# Altium schematic sheet CONTINUE.SchDoc
size 420 x 297 mm; SheetNumber: 5; SheetTotal: 5
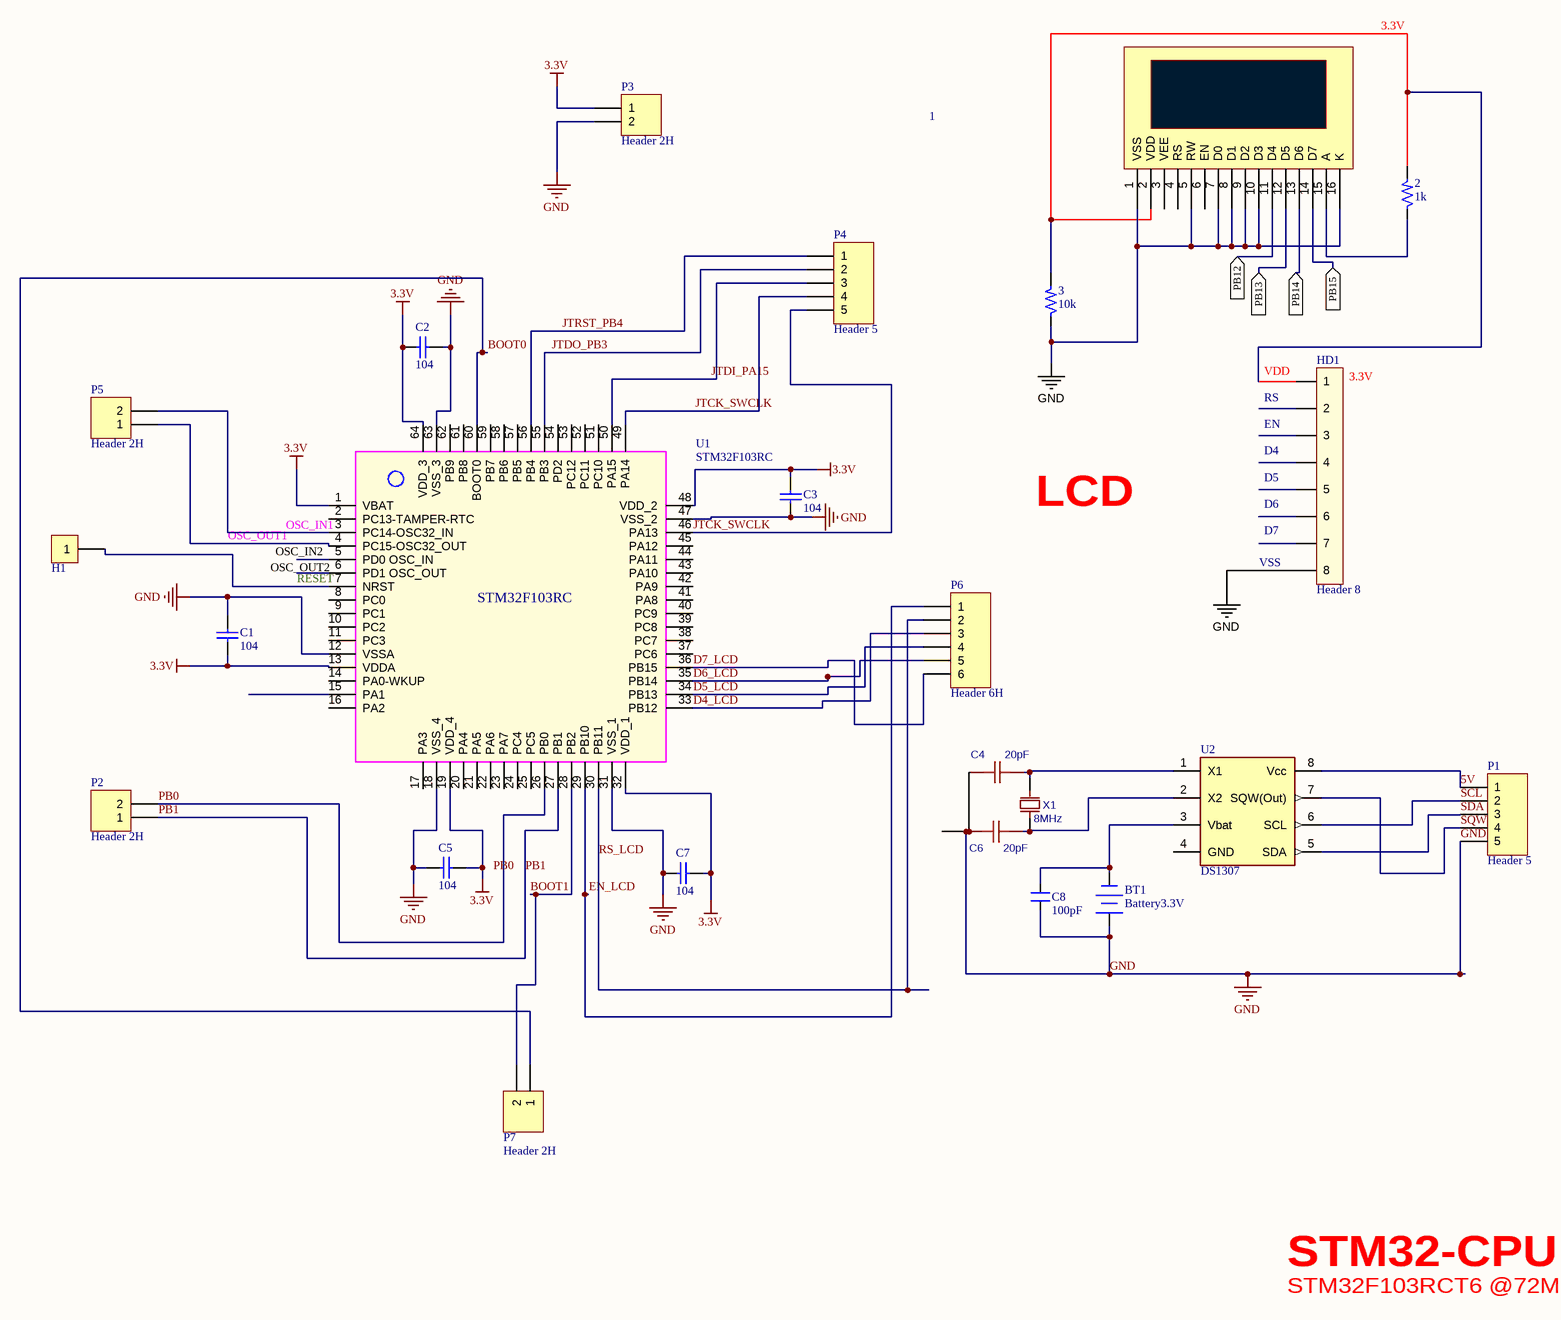
[diagram p0: CONTINUE.SchDoc]

## Parts
1  LCD  [LCD16X2]  (value not drawn)
2  1k  [R1/6W]
3  10k  [R1/6W]
BT1  Battery3.3V  [CR2032 Holder]
C1  104  [0805]
C2  104  [0805]
C3  104  [0805]
C4  20pF  [C0603]
C5  104  [0805]
C6  20pF  [C0603]
C7  104  [0805]
C8  100pF  [CN1]
H1  Header 1  [HEAD1]  (value not drawn)
HD1  Header 8  [HED8V]
P1  Header 5
P2  Header 2H  [HDR1X2H]
P3  Header 2H  [HDR1X2H]
P4  Header 5
P5  Header 2H  [HDR1X2H]
P6  Header 6H  [HDR1X6H]
P7  Header 2H  [HDR1X2H]
U1  STM32F103RC  [STM32F103RC_TSQFP]
U2  DS1307  [DIP.100/8/W.300/L.400]
X1  8MHz  [HC-49SMD]

## Ports
PB12 (in), PB13 (in), PB14 (in), PB15 (in)

## Nets
3.3V: C1.1 C2.1 C3.1 C5.1 C7.1 P3.1 U1.1(VBAT) U1.13(VDDA) U1.19(VDD_4) U1.32(VDD_1) U1.48(VDD_2) U1.64(VDD_3)
GND: 1.1(VSS) 1.5(RW) 1.7(D0) 1.8(D1) 1.9(D2) 1.10(D3) 1.16(K) 3.1 BT1.1(+) C1.2 C2.2 C3.2 C4.1 C5.2 C6.1 C7.2 C8.1 HD1.8 P1.5 P3.2 U1.12(VSSA) U1.18(VSS_4) U1.31(VSS_1) U1.47(VSS_2) U1.63(VSS_3)
5V: P1.1 U2.8(Vcc)
BOOT0: P7.1 U1.60(BOOT0)
BOOT1: P7.2 U1.28(PB2)
D4_LCD: P6.3 U1.33(PB12)
D5_LCD: P6.4 U1.34(PB13)
D6_LCD: P6.5 U1.35(PB14)
D7_LCD: P6.6 U1.36(PB15)
EN_LCD: P6.1 U1.29(PB10)
JTCK_SWCLK: P4.4 P4.5 U1.46(PA13) U1.49(PA14)
JTDI_PA15: P4.3 U1.50(PA15)
JTDO_PB3: P4.2 U1.55(PB3)
JTRST_PB4: P4.1 U1.56(PB4)
OSC_IN1: P5.2 U1.3(PC14-OSC32_IN)
OSC_OUT1: P5.1 U1.4(PC15-OSC32_OUT)
PB0: P2.2 U1.26(PB0)
PB1: P2.1 U1.27(PB1)
PB12: 1.11(D4) ; port PB12
PB13: 1.12(D5) ; port PB13
PB14: 1.13(D6) ; port PB14
PB15: 1.14(D7) ; port PB15
RESET: H1.1 U1.7(NRST)
RS_LCD: P6.2 U1.30(PB11)
SCL: P1.2 U2.6(SCL)
SDA : P1.3 U2.5(SDA)
SQW: P1.4 U2.7(SQW(Out))
Net1_2: 1.2(VDD) 2.2 3.2 HD1.1
Net1_15: 1.15(A) 2.1
NetBT1_2: BT1.2(-) C8.2 U2.3(Vbat)
NetC4_2: C4.2 U2.1(X1) X1.1(OSC1)
NetC6_2: C6.2 U2.2(X2) X1.2(OSC2)

Not connected (* = marked no-connect by the designer): 1 3(VEE) 4(RS) 6(EN); HD1 2 3 4 5 6 7; U1 2(PC13-TAMPER-RTC) 5(PD0_OSC_IN) 6(PD1_OSC_OUT) 8(PC0) 9(PC1) 10(PC2) 11(PC3) 14(PA0-WKUP) 15(PA1) 16(PA2) 17(PA3) 20(PA4) 21(PA5) 22(PA6) 23(PA7) 24(PC4) 25(PC5) 37(PC6) 38(PC7) 39(PC8) 40(PC9) 41(PA8) 42(PA9) 43(PA10) 44(PA11) 45(PA12) 51(PC10) 52(PC11) 53(PC12) 54(PD2) 57(PB5) 58(PB6) 59(PB7) 61(PB8) 62(PB9); U2 4(GND)

## Notes on the sheet
- 3.3V
- (near HD1) RS
- (near HD1) EN
- (near HD1) VDD
- (near HD1) 3.3V
- (near HD1) D5
- (near HD1) D4
- LCD
- (near HD1) VSS
- (near HD1) D6
- (near HD1) D7
- STM32-CPU
- STM32F103RCT6 @72MHz
- Labels drawn without touching a wire or pin: OSC_IN2, OSC_OUT2, PB0
- THIS DOCUMENT AND THE DATA DISCLOSED HEREIN OR
- HEREWITH IS THE PROPERTY OF ALTIUM LIMITED AND MAY
- DWG NO:
- REVISION
- REV:
- DESCRIPTION
- DATE
- APPROVED
- BE FREELY DISTRIBUTED IN WHOLE. NO RIGHTS ARE
- RESERVED OR EXPRESS OR IMPLIED WARANTEE GIVEN.
- ENG:
- APPROVALS
- PROJECT
- DSN:
- CHK:
- REFERENCE DOCUMENTS
- PROJECT REVISION:
- TITLE
- DOCUMENT REVISION:
- DESIGN ITEM:
- BOM:
- FAB DWG:
- PCB DWG:
- ASSY DWG:
- SCALE:
- A3
- SIZE
- CAGE CODE
- FILE NAME
- DWG NO.
- SHEET
- OF
- REV

## Library data of the parts
1 = LCD: Value: LCD16x2
2 3 = Res: Resistor 1/4W; Value: R1/4W - 1K
BT1 = Battery3.3V: Multicell Battery; Published: 24-Mar-1999; LatestRevisionDate: 17-Jul-2002; LatestRevisionNote: Re-released for DXP Platform.; PackageReference: BAT-2; Publisher: Altium Limited
C1-C3 C5 C7 = Cap 104_SMD: Capacitor (Semiconductor SIM Model); Value: 0.1uF; Published: 8-Jun-2000; LatestRevisionDate: 17-Jul-2002; LatestRevisionNote: Re-released for DXP Platform.; PackageReference: C1206; Publisher: Altium Limited
C4 C6 = 20pF: BOM_Manufacturer: FH; BOM_Manufacturer Part: 0603CG200J500NT; nameAlias: Capacitance; BOM_Supplier: LCSC; BOM_Supplier Part: C91702; spicePre: C; spiceSymbolName: 0603CG200J500NT
C8 = CN1: Cap np  1pF - 472pF; Value: 100pF
H1 = Header 1: Header, 1-Pin, Right Angle; Revised: Zion Blue; Published: 6-May-2014; Publisher: Cynetik Group
HD1 = Header 8: Header 8 Vit Broad
P1 P4 = Header 5: Header, 5-Pin; LatestRevisionDate: 17-Jul-2002; LatestRevisionNote: Re-released for DXP Platform.; Publisher: Altium Limited
P2 P3 P5 P7 = Header 2H: Header, 2-Pin, Right Angle; LatestRevisionDate: 17-Jul-2002; LatestRevisionNote: Re-released for DXP Platform.; Publisher: Altium Limited
P6 = Header 6H: Header, 6-Pin, Right Angle; LatestRevisionDate: 17-Jul-2002; LatestRevisionNote: Re-released for DXP Platform.; Publisher: Altium Limited
U1 = STM32F103RC: Performance line, ARM-based 32-bit MCU with up to 512 KB Flash,  USB, CAN, 11 timers, 3 ADCs and 13 communication interfaces; Value: STM32F103RC
U2 = DS1307: 64 X 8 Serial Real-Time Clock
X1 = 8MHz: BOM_Manufacturer: TAE; BOM_Manufacturer Part: HC-49SM8MHz20pF30ppm; nameAlias: Frequency; Contributor: T. Ruiz; BOM_Supplier: LCSC; BOM_Supplier Part: C107426; spicePre: X; spiceSymbolName: HC-49SM8MHz20pF30ppm